# EAGLE design CMoy-Pro-V_1_0_0_2a (EAGLE 6.4)
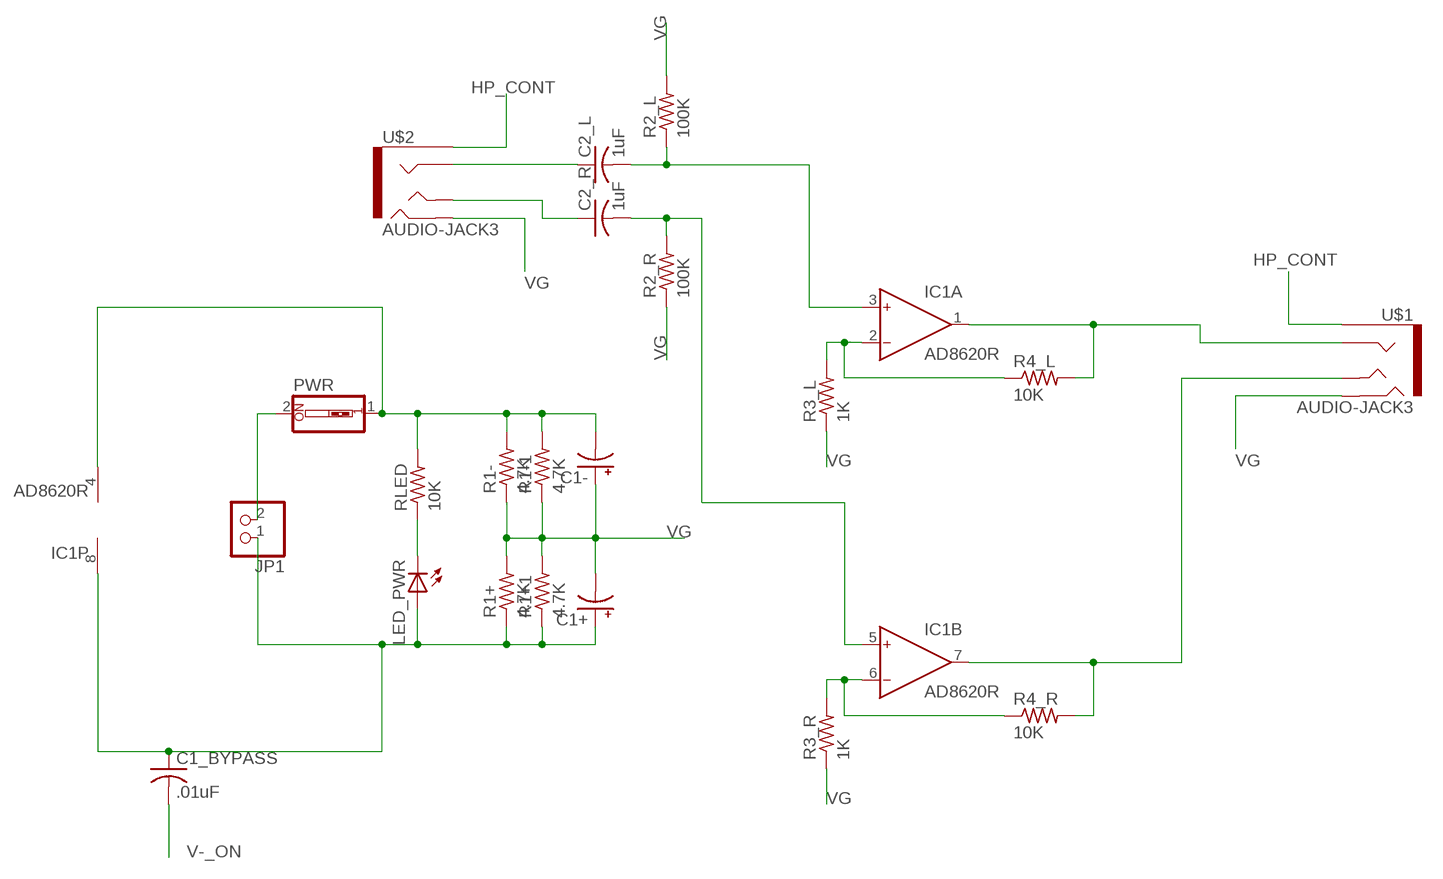
[diagram p0: schematic, sheet 1]

## Parts
C1+  CPOL-US140CLH-0810  [140CLH-0810]
C1-  CPOL-US140CLH-0810  [140CLH-0810]
C1_BYPASS  .01uF  C-USC0603  [C0603]
C2_L  1uF  C-USC1210  [C1210]
C2_R  1uF  C-USC1210  [C1210]
IC1  AD8620R  [SO8]
JP1  PINHD-1X2  [1X02]
LED_PWR  LEDCHIP-LED0603  [CHIP-LED0603]
PWR  SW_DIP-1  [EDG-01]
R1+  4.7K  R-US_R0603  [R0603]
R1+1  4.7K  R-US_R0603  [R0603]
R1-  4.7K  R-US_R0603  [R0603]
R1-1  4.7K  R-US_R0603  [R0603]
R2_L  100K  R-US_R0603  [R0603]
R2_R  100K  R-US_R0603  [R0603]
R3_L  1K  R-US_R0603  [R0603]
R3_R  1K  R-US_R0603  [R0603]
R4_L  10K  R-US_R0603  [R0603]
R4_R  10K  R-US_R0603  [R0603]
RLED  10K  R-US_R0603  [R0603]
U$1  AUDIO-JACK3  [AUDIO-JACK-TRRS-SMD]
U$2  AUDIO-JACK3  [AUDIO-JACK-TRRS-SMD]

## Nets
HP_CONT: U$1.EARTH U$2.EARTH
HP_L: C2_R.1 U$2.TIP
HP_R: C2_L.1 U$2.RING1
IN_L: C2_R.2 IC1.5(B:IN+) R2_R.2
IN_R: C2_L.2 IC1.3(A:IN+) R2_L.1
N$3: LED_PWR.C RLED.1
N$5: IC1.2(A:IN-) R3_L.2 R4_L.1
N$6: IC1.6(B:IN-) R3_R.2 R4_R.1
OUT_L: IC1.7(B:OUT) R4_R.2 U$1.TIP
OUT_R: IC1.1(A:OUT) R4_L.2 U$1.RING1
V+: C1+.+ C1_BYPASS.1 IC1.8(P:V+) JP1.1 LED_PWR.A R1+1.1 R1+.1
V-: JP1.2 PWR.2
V-_ON: C1-.- C1_BYPASS.2 IC1.4(P:V-) PWR.1 R1-1.2 R1-.2 RLED.2
VG: C1+.- C1-.+ R1+1.2 R1+.2 R1-1.1 R1-.1 R2_L.2 R2_R.1 R3_L.1 R3_R.1 U$1.RING2 U$2.RING2

## Library data of the parts
C1+ C1- = rcl:CPOL-US: POLARIZED CAPACITOR, American symbol
C1_BYPASS C2_L C2_R = rcl:C-US: CAPACITOR, American symbol
IC1 = analog-devices:AD8620: Precision, Very Low Noise, Low Input Bias Current, Wide Bandwidth JFET Operational Amplifiers Source: http://www.analog.com/static/imported-files/data_sheets/AD8610_8620.pdf; MF: ALTERA CORPORATION; MPN: AD8620ARZ; OC_FARNELL: 9994386; OC_NEWARK: 59K6972
JP1 = pinhead:PINHD-1X2: PIN HEADER
LED_PWR = adafruit:LED: LED OSRAM: - CHIPLED LG R971, LG N971, LY N971, LG Q971, LY Q971, LO R971, LY R971 LH N974, LH R974 LS Q976, LO Q976, LY Q976 LO Q996 - Hyper CHIPLED LW Q18S LB Q993, LB Q99A, LB R99A - SideLED LS A670, LO A670, LY A670, LG A670, LP A670 LB A673, LV A673, LT A673, LW A673 LH A674 LY A675 LS A676, LA A676, LO A676, LY A676, LW A676 LS A679, LY A679, LG A679 - Hyper Micro SIDELED® LS Y876, LA Y876, LO Y876, LY Y876 LT Y87S - SmartLED LW L88C, LW L88S LB L89C, LB L89S, LG L890 LS L89K, LO L89K, LY L89K LS L896, LA L896, LO L896, LY L896 - TOPLED LS T670, LO T670, LY T670, LG T670, LP T670 LSG T670, LSP T670, LSY T670, LOP T670, LYG T670 LG T671, LOG T671, LSG T671 LB T673, LV T673, LT T673, LW T673 LH T674 LS T676, LA T676, LO T676, LY T676, LB T676, LH T676, LSB T676, LW T676 LB T67C, LV T67C, LT T67C, LS T67K, LO T67K, LY T67K, LW E67C LS E67B, LA E67B, LO E67B, LY E67B, LB E67C, LV E67C, LT E67C LW T67C LS T679, LY T679, LG T679 LS T770, LO T770, LY T770, LG T770, LP T770 LB T773, LV T773, LT T773, LW T773 LH T774 LS E675, LA E675, LY E675, LS T675 LS T776, LA T776, LO T776, LY T776, LB T776 LHGB T686 LT T68C, LB T68C - Hyper Mini TOPLED® LB M676 - Mini TOPLED Santana® LG M470 LS M47K, LO M47K, LY M47K Source: http://www.osram.convergy.de/
PWR = special:SW_DIP-1: DIP SWITCH
R1+ R1+1 R1- R1-1 R2_L R2_R R3_L R3_R R4_L R4_R RLED = rcl:R-US_: RESISTOR, American symbol
U$1 U$2 = SparkFun-Connectors:AUDIO-JACK3: Audio jack - 3.5mm TRRS variety - two rings.

## Board
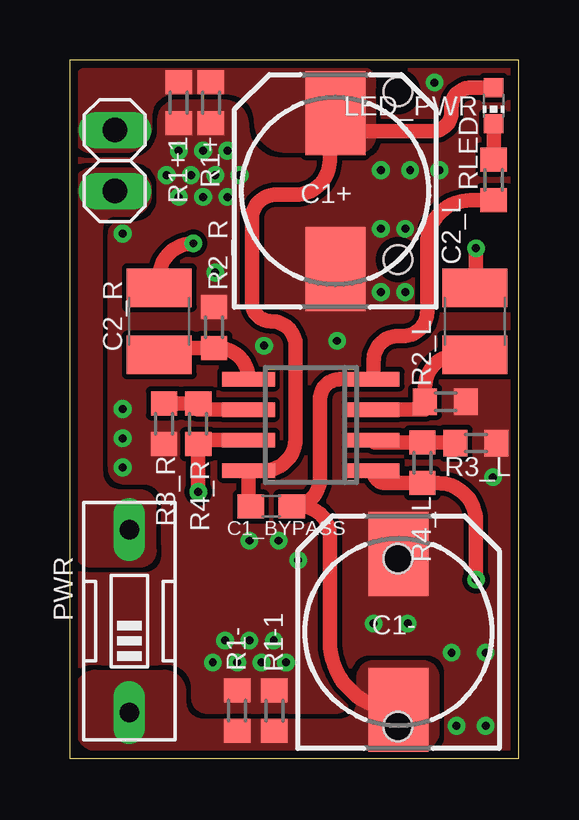
[diagram p1: board, top side]
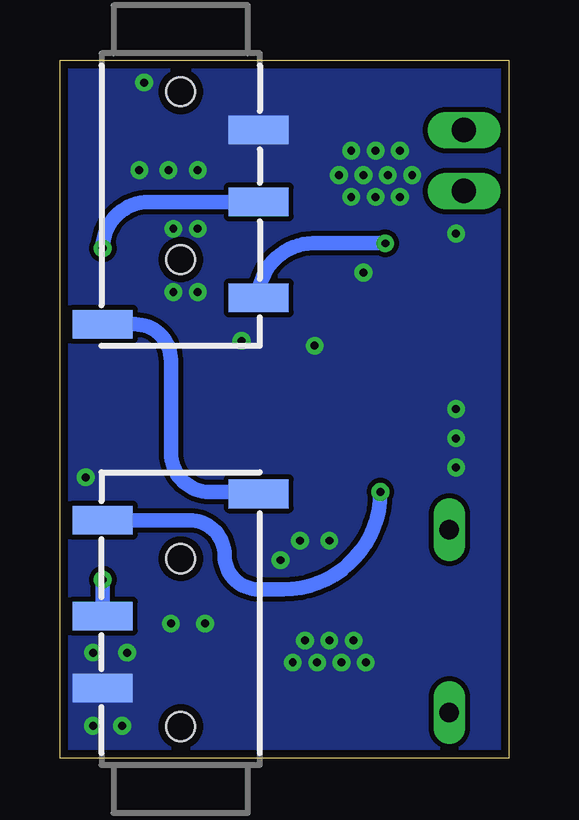
[diagram p2: board, bottom side, seen from below]

Size 18.73 x 29.11 mm. Coordinates in mm from the lower left corner, seen from the top.
Outline: 0,0 18.73,0 18.73,29.11 0,29.11 0,0
Copper layers (1*16): Top 0.035mm / dielectric 1.5mm / Bottom 0.035mm
Design rules "default *": minimum track width 10mil, minimum drill 24mil, track to track 8mil, track to pad 8mil, pad to pad 8mil, via to via 8mil, smd to smd 8mil, copper to edge 13mil, drill to drill 8mil, minimum pad ring 10mil, minimum via ring 8mil, stop-mask expansion 4mil, vias tented up to drill 0mil, thermal gap 10mil

### Footprints (pad centres in the part's own frame; a part is rotated, then mirrored left to right if it is on the bottom)
140CLH-0810 = smd 3.5 x 2.5: + 3.25,0; - -3.25,0
C0603 = smd 1.1 x 1: 1 -0.85,0; 2 0.85,0
C1210 = smd 1.6 x 2.7: 1 -1.4,0; 2 1.4,0
SO8 = smd 0.6 x 2.2: 1 -1.905,-2.6; 2 -0.635,-2.6; 3 0.635,-2.6; 4 1.905,-2.6; 5 1.905,2.6; 6 0.635,2.6; 7 -0.635,2.6; 8 -1.905,2.6
1X02 = drill 1.016 long: 1 -1.27,0; 2 1.27,0
CHIP-LED0603 = smd 0.8 x 0.8: A 0,-0.75; C 0,0.75
EDG-01 = drill 0.813 long: 1 0,-3.81; 2 0,3.81
R0603 = smd 1 x 1.1: 1 -0.85,0; 2 0.85,0
AUDIO-JACK-TRRS-SMD = smd 1.2 x 2.5: EARTH 11.3,-3.25; RING1 6.2,3.25; RING2 3.2,3.25; TIP 10.2,3.25 | hole 1.2: 1.6,0; 8.6,0

### Placement (x,y rotation side)
C1+  11.07,23.65 90 top
C1-  13.72,5.26 90 top
C1_BYPASS  8.41,10.49 0 top
C2_L  16.89,18.21 270 top
C2_R  3.73,18.21 270 top
IC1  10.06,13.89 90 top
JP1  1.88,24.92 270 top
LED_PWR  17.68,27.2 180 top
PWR  2.49,5.72 0 top
R1+  5.89,27.33 270 top
R1+1  4.55,27.33 270 top
R1-  6.99,1.98 270 top
R1-1  8.53,1.98 270 top
R2_L  15.67,14.86 0 top
R2_R  6.02,17.96 270 top
R3_L  16.94,13.13 180 top
R3_R  3.94,13.94 90 top
R4_L  14.71,12.32 270 top
R4_R  5.36,13.94 270 top
RLED  17.68,24.1 270 top
U$1  13.69,-0.28 90 bottom
U$2  13.69,29.39 270 bottom

### Tracks (layer width: path | path; a pad name or v marks a point on that pad's centre or on a via)
HP_CONT
  Bottom 0.61: U$2.EARTH 15.6,18.09 arc90 14.1,16.59 14.1,12.73 arc-90 12.47,11.1 10.52,11.1 arc90 U$1.EARTH
HP_L  (via drill 0.33)
  Top 0.61: C2_R.1 3.73,20.04 arc-90 v5.16,21.46
  Bottom 0.61: v5.16,21.46 8.17,21.46 arc-90 U$2.TIP
HP_R  (via drill 0.33)
  Top 0.61: v16.94,21.26 16.94,19.66 arc-90 C2_L.1
  Bottom 0.61: U$2.RING1 15.01,23.19 arc-90 v16.94,21.26
IN_L
  Top 0.61: C2_R.2 3.73,17.11 R2_R.2 6.15,17.11 arc-90 IC1.5
IN_R
  Top 0.61: IC1.3 14.82,14.53 R2_L.1 14.82,15.48 arc-90 16.13,16.79 16.87,16.79 arc90 C2_L.2
N$3
  Top 0.61: LED_PWR.C RLED.1
N$5
  Top 0.61: IC1.2 arc90 12.75,13.17 R4_L.1 16.05,13.17 arc-90 R3_L.2
N$6
  Top 0.61: IC1.6 5.36,14.53 R4_R.1 R3_R.2
OUT_L  (via drill 0.33)
  Top 0.61: IC1.7 5.36,13.26 R4_R.2 v5.36,11.1
  Bottom 0.61: U$1.TIP 13.32,9.92 arc90 11.86,8.46 arc-90 10.44,7.04 9.42,7.04 arc-90 v5.36,11.1
OUT_R  (via drill 0.33)
  Top 0.61: IC1.1 arc90 13.18,11.47 R4_L.2 15.35,11.47 arc-90 16.94,9.88 v16.94,7.44
  Bottom 0.61: v16.94,7.44 U$1.RING1 arc-90 U$1.RING1
V+
  Top 0.61: C1_BYPASS.1 7.46,10.49 IC1.8 8.08,11.99 arc90 9.42,13.34 9.42,17.2 arc90 8.41,18.21 arc-90 7.59,19.02 7.59,22.48 arc-90 8.61,23.5 9.42,23.5 arc90 10.85,24.92 10.85,26.67 arc-90 C1+.+ arc90 11.84,26.14 15.11,26.14 arc90 15.93,26.95 15.93,27.15 arc-90 16.73,27.95 LED_PWR.A
  pour Top (rank 5, no thermals): 11.25,25.32 9.02,25.32 arc-90 7.8,26.54 arc90 6.58,27.76 4.34,27.76 arc90 3.33,26.75 3.33,26.34 arc-90 2.31,25.32 0.89,25.32 arc-90 0.28,25.93 0.28,28.17 arc-90 0.89,28.78 12.07,28.78 arc-90 12.67,28.17 12.67,25.93 arc-90 12.07,25.32
V-
  pour Top (no thermals): 1.5,24.51 0.89,24.51 arc90 0.28,23.9 0.28,8.66 arc90 0.89,8.05 2.92,8.05 arc90 3.53,8.66 3.53,10.49 arc90 2.92,11.1 2.11,11.1 arc-90 1.3,11.91 1.3,22.07 arc-90 1.91,22.68 2.51,22.68 arc90 3.33,23.5 3.33,23.7 arc90 2.51,24.51
V-_ON
  Top 0.61: C1-.- arc-90 10.85,4.88 10.85,9.27 arc90 9.63,10.49 C1_BYPASS.2 arc90 10.44,11.67 10.44,14.96 arc-90 11.28,15.8 IC1.4 arc90 12.67,15.82 12.67,16.59 arc-90 13.69,17.6 13.89,17.6 arc90 14.91,18.62 14.91,21.46 arc-90 16.7,23.26 RLED.2
  pour Top (rank 5, no thermals): 2.11,3.58 3.94,3.58 arc-90 4.75,2.77 4.75,2.36 arc90 5.56,1.55 11.25,1.55 arc90 12.07,2.36 12.07,3.38 arc-90 12.67,3.99 14.71,3.99 arc-90 15.32,3.38 15.32,1.14 arc-90 14.5,0.33 1.3,0.33 arc-90 0.28,1.35 0.28,2.77 arc-90 1.09,3.58
VG  (via drill 0.33)
  other vias: 4.55,25.32 5.56,25.32 6.58,25.32 7.09,24.31 6.07,24.31 5.05,24.31 4.04,24.31 6.99,3.99 8,3.99 9.02,3.99 5.97,3.99 6.48,4.9 7.49,4.9 8.51,4.9 12.67,5.61 14.1,5.61 15.93,4.39 17.35,4.39 17.35,1.35 16.13,1.35 14.2,24.51 12.98,24.51 15.42,24.51 12.98,22.07 14,22.07 12.98,19.43 14,19.43 11.15,17.4 6.07,20.24 8.1,17.2 2.21,12.12 2.21,13.34 2.21,14.55 2.21,21.87 17.65,11.71 7.49,9.07 8.71,9.07 9.53,8.26 4.55,23.39 5.56,23.39 6.58,23.39 15.21,28.17
  pour Bottom (rank 6, no thermals): 0.28,28.78 18.36,28.78 18.36,0.33 0.28,0.33 0.28,28.57
  pour Top (rank 6, no thermals): 0.28,28.78 18.36,28.78 18.36,0.33 0.28,0.33